# EAGLE design PoweredAudio (EAGLE 6.5.0)
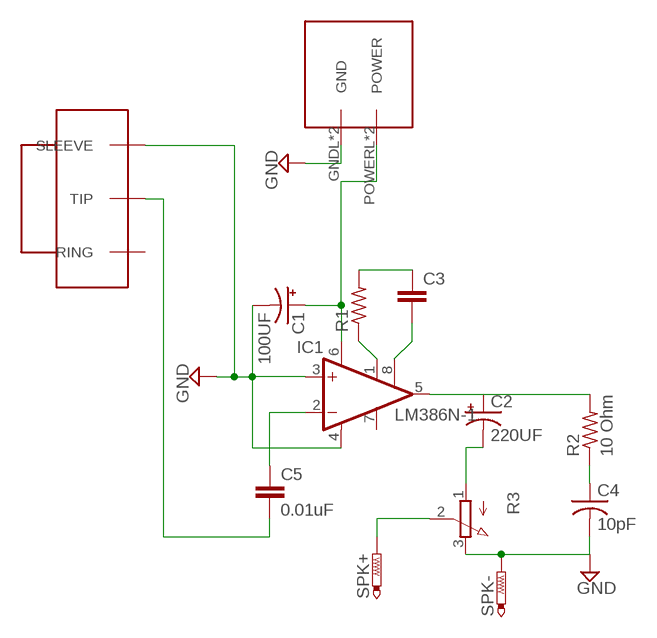
[diagram p0: schematic, sheet 1]

## Parts
C1  100UF  CPOL-USE2.5-7  [E2,5-7]
C2  220UF  CPOL-USE2.5-7  [E2,5-7]
C3  C-EU025-025X050  [C025-025X050]
C4  10pF  C-USC1206  [C1206]
C5  0.01uF  C2.5/2  [C2.5-2]
IC1  LM386N-1  [DIL08]
R1  R-US_0204/5  [0204/5]
R2  10 Ohm  R-US_M1206  [M1206]
R3  3RP/1610N  [3RP/1610N]
SPK+  PTR1PAD1-13Y  [P1-13Y]
SPK-  PTR1PAD1-13Y  [P1-13Y]
U$1  SJ-352X  [SJ1-352XN]
U$2  2X2-MOLEX  [2X2MOLEX]

## Nets
GND: C1.- C4.2 IC1.3(+IN) IC1.4(GND) R3.3(E) SPK-.TP U$1.SLEEVE U$2.GNDL(GND) U$2.GNDR(GND)
N$1: C4.1 R2.1
N$2: C1.+ IC1.6(VS) U$2.POWERL(POWER) U$2.POWERR(POWER)
N$3: C3.1 R1.2
N$4: C2.+ IC1.5(OUT) R2.2
N$5: IC1.1(GAIN) R1.1
N$6: C3.2 IC1.8(GAIN)
N$7: C5.1 IC1.2(-IN)
N$8: C5.2 U$1.TIP
N$9: C2.- R3.1(A)
N$10: R3.2(S) SPK+.TP
Unconnected: IC1.7(BYPASS) U$1.RING

## Library data of the parts
C1 C2 = resistor:CPOL-US: POLARIZED CAPACITOR, American symbol
C3 = resistor:C-EU: CAPACITOR, European symbol
C4 = resistor:C-US: CAPACITOR, American symbol
C5 = capacitor-wima:C: CAPACITOR naming: grid - package width
IC1 = linear:LM386?-*: Low Voltage Audio Power Amplifier Source: http://cache.national.com/ds/LM/LM386.pdf
R1 = resistor:R-US_: RESISTOR, American symbol
R2 = rcl:R-US_: RESISTOR, American symbol
R3 = potModified:3RP/1610N: 16mm Potentiometer one level Source: http://www.alphapotentiometers.net/html/16mm_pot_2.html
SPK+ SPK- = testpad:PTR1: TEST PIN
U$1 = CUI SJ1-325XN:SJ-352X
U$2 = Molex:2X2-MOLEX

## Board
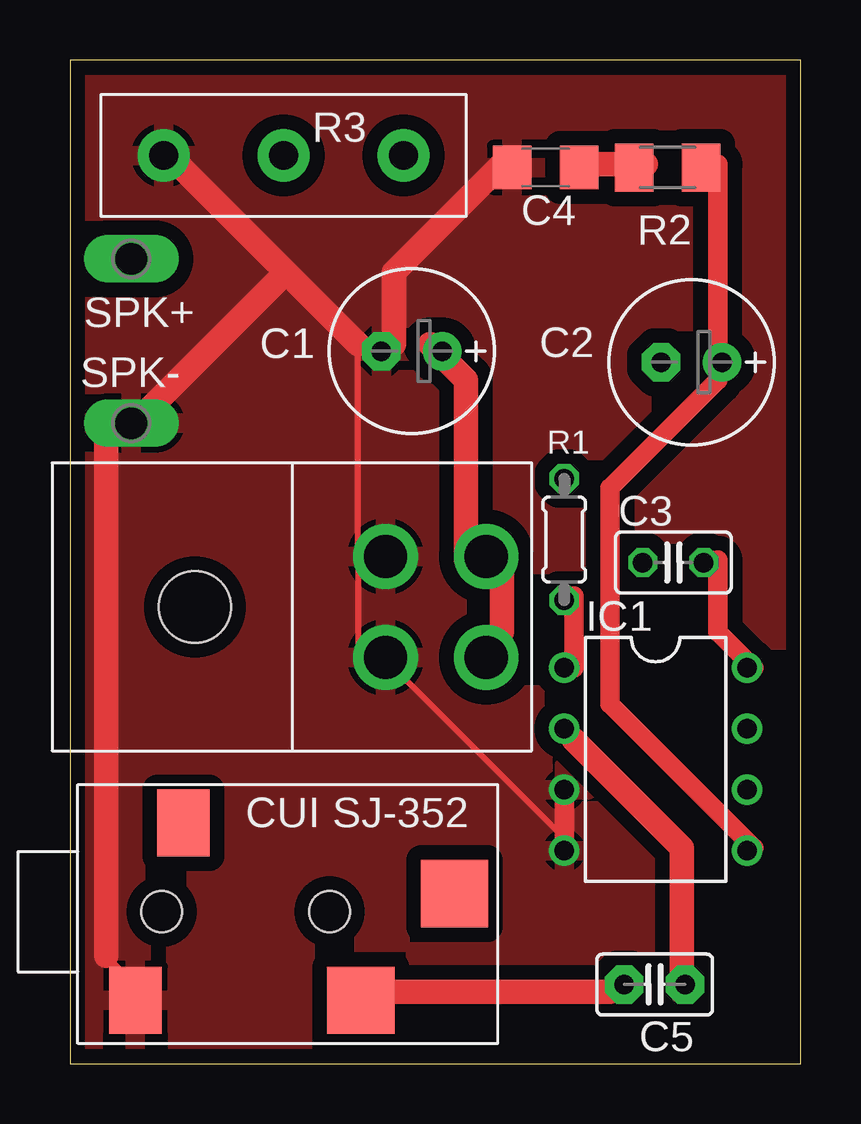
[diagram p1: board, top side]
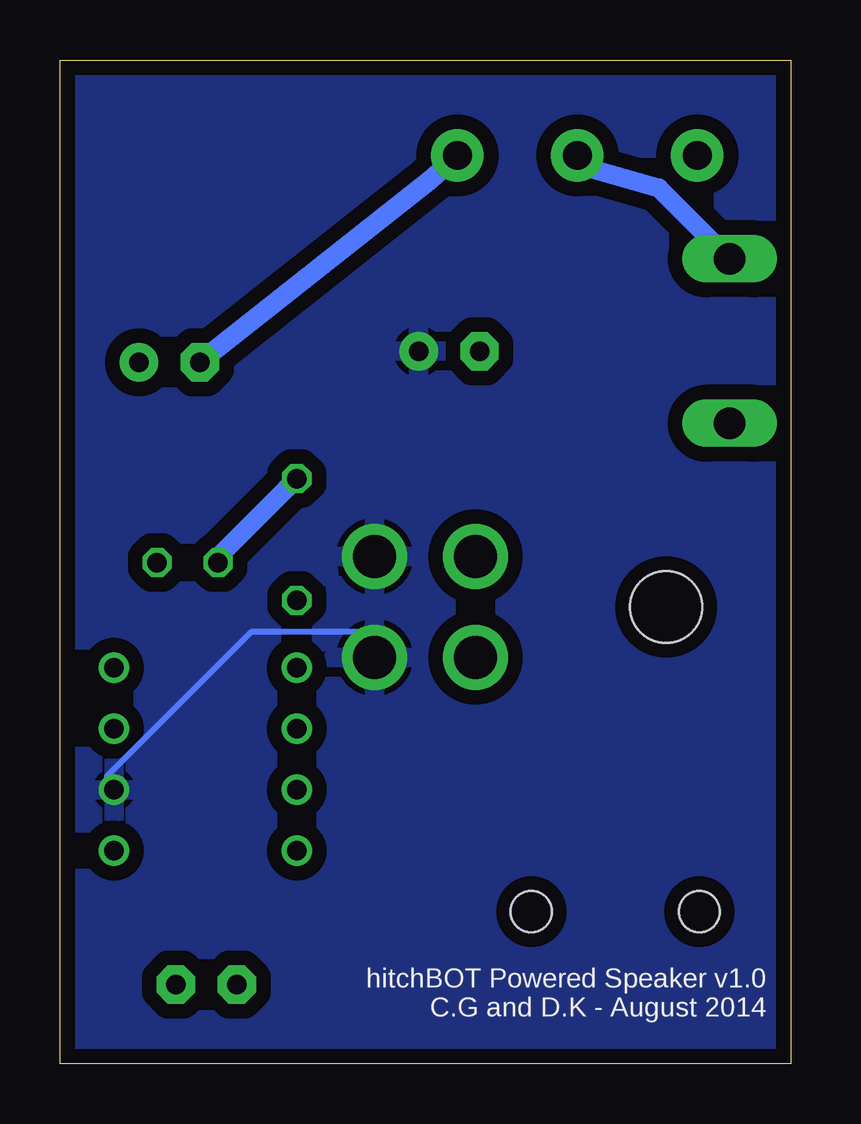
[diagram p2: board, bottom side, seen from below]

Size 30.46 x 41.85 mm. Coordinates in mm from the lower left corner, seen from the top.
Outline: 0,0 30.46,0 30.46,41.85 0,41.85 0,0
Copper layers (1*16): Top 0.0356mm / dielectric 1.5011mm / Bottom 0.0356mm
Design rules "LaenPCBOrder": minimum track width 6mil, minimum drill 13mil, track to track 6mil, track to pad 6mil, pad to pad 6mil, via to via 6mil, smd to smd 6mil, copper to edge 15mil, drill to drill 6mil, minimum pad ring 7mil, minimum via ring 7mil, stop-mask expansion 3mil, vias tented up to drill 0mil, thermal gap 10mil

### Footprints (pad centres in the part's own frame; a part is rotated, then mirrored left to right if it is on the bottom)
E2,5-7 = drill 0.813 pad 1.6: + -1.27,0 | drill 0.813 pad 1.6 octagon: - 1.27,0
C025-025X050 = drill 0.813 octagon: 1 -1.27,0; 2 1.27,0
C1206 = smd 1.6 x 1.8: 1 -1.4,0; 2 1.4,0
C2.5-2 = drill 0.813 pad 1.6 octagon: 1 -1.27,0; 2 1.27,0
DIL08 = drill 0.813 pad 1.27: 1 -3.81,-3.81; 2 -1.27,-3.81; 3 1.27,-3.81; 4 3.81,-3.81; 5 3.81,3.81; 6 1.27,3.81; 7 -1.27,3.81; 8 -3.81,3.81
0204/5 = drill 0.813 octagon: 1 -2.54,0; 2 2.54,0
M1206 = smd 1.6 x 2: 1 -1.4,0; 2 1.4,0
3RP/1610N = drill 1.2 pad 2.184: 1 -5,0; 2 0,0; 3 5,0
P1-13Y = drill 1.321 pad 1.905 long: TP 0,0
SJ1-352XN = smd 2.8 x 2.8: NULL 12.2,0.75; TIP 8.3,-3.7 | smd 2.2 x 2.8: RING 0.9,3.7; SLEEVE -1.1,-3.7 | hole 1.7: 0,0; 7,0
2X2MOLEX = drill 1.8: GNDL -2.1,-2.1; GNDR 2.1,-2.1; POWERL -2.1,2.1; POWERR 2.1,2.1 | hole 3: 0,-10.05

### Placement (x,y rotation side)
C1  14.24,29.71 180 top
C2  25.9,29.25 180 top
C3  25.14,20.9 0 top
C4  19.82,37.37 180 top
C5  24.36,3.31 180 top
IC1  24.4,12.7 270 top
R1  20.59,21.86 90 top
R2  24.9,37.37 0 top
R3  8.89,37.87 180 top
SPK+  2.54,33.56 270 top
SPK-  2.54,26.71 270 top
U$1  3.81,6.35 0 top
U$2  15.24,19.05 270 top

### Tracks (layer width: path | path; a pad name or v marks a point on that pad's centre or on a via)
GND
  Top 0.254: 1.5,4.5 3,3 U$1.SLEEVE | IC1.4 21,9 13.5,16.5 U$2.GNDR 12,16.5 12,21 | 18,37.5 C4.2 | 12,21 12,30 13.5,30 C1.- | 12,21 U$2.GNDL | 3,27 SPK-.TP
  Top 0.813: IC1.3 IC1.4
  Top 1.016: 1.5,4.5 1.5,27 SPK-.TP | 18,37.5 13.5,33 13.5,30 | 12,30 9,33 | 9,33 4.5,37.5 R3.3 | 9,33 3,27
  pour Top (isolate 0.61): -4.5,43 34.5,43 34.5,-2 -4.5,-2
N$1
  Top 0.254: 21,37.5 C4.1 | 24,37.5 R2.1
  Top 1.016: 24,37.5 21,37.5
N$2
  Top 0.254: 15,30 C1.+
  Top 1.016: 15,30 16.5,28.5 16.5,21 U$2.POWERL 18,21 18,18 U$2.POWERR
  Bottom 0.254: IC1.6 28.5,12 22.5,18 18,18 U$2.POWERR
  pour Bottom (isolate 0.61): -3.5,42 32,42 32,-2.5 -3.5,-2.5
N$3
  Bottom 0.254: 24,21 C3.1 | 21,24 R1.2
  Bottom 0.813: 21,24 24,21
N$4
  Top 0.254: 27,37.5 R2.2 | 28.5,9 IC1.5 | 27,28.5 C2.+
  Top 0.813: 27,37.5 27,30 C2.+ | 28.5,9 22.5,15 22.5,24 27,28.5
N$5
  Top 0.813: IC1.1 21,16.5 21,19.5 R1.1
N$6
  Top 0.813: IC1.8 28.5,16.5 27,18 27,21 C3.2
N$7
  Top 0.254: 21,13.5 IC1.2
  Top 1.016: 21,13.5 25.5,9 25.5,3 C5.1
N$8
  Top 0.254: 13.5,3 U$1.TIP
  Top 1.016: 13.5,3 22.5,3 C5.2
N$9
  Bottom 0.813: R3.1 15.01,36.87 C2.-
N$10
  Bottom 0.254: 2.5,33.5 SPK+.TP | 9,37.5 R3.2
  Bottom 0.813: 2.5,33.5 5.5,36.5 9,37.5

### Text on the board
bPlace: hitchBOT Powered Speaker v1.0 / C.G and D.K - August 2014